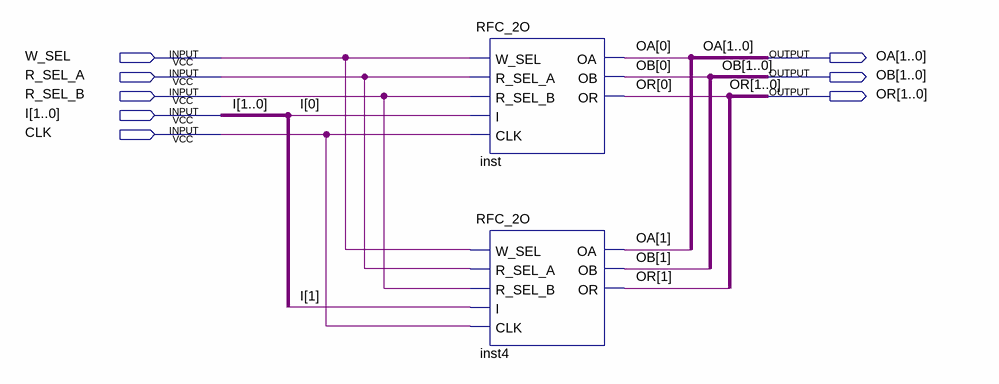
[diagram p0: schematic sheet]
// Quartus schematic RF_1x2_2O.bdf as structural Verilog: 2 symbols, 8 pins
module RF_1x2_2O (
  input  W_SEL,
  input  R_SEL_A,
  input  R_SEL_B,
  input  [1:0] I,
  input  CLK,
  output [1:0] OA,
  output [1:0] OB,
  output [1:0] OR
);

  RFC_2O inst (
    .W_SEL(W_SEL), .R_SEL_A(R_SEL_A), .R_SEL_B(R_SEL_B), .I(I[0]), .CLK(CLK), .OA(OA[0]), .OB(OB[0]),
    .OR(OR[0]));
  RFC_2O inst4 (
    .W_SEL(W_SEL), .R_SEL_A(R_SEL_A), .R_SEL_B(R_SEL_B), .I(I[1]), .CLK(CLK), .OA(OA[1]), .OB(OB[1]),
    .OR(OR[1]));
endmodule
